# Altium schematic sheet NG2092_MICS.SchDoc: =project_title
size Tabloid; PageSetup: Record=PageOptions|CenterHorizontal=True|CenterVertical=True|PrintScale=0.73|XCorrection=1.00|YCorrection=1.00|PrintKind=0|BorderSize=5000000|LeftOffset=0|BottomOffset=0|Orientation=2|PaperLength=1000|PaperWidth=1000|Scale=100|PaperSource=7|PrintQuality=-4|MediaType=1|DitherType=10|PaperKind=A4|PrintScaleMode=1; CompanyName: Luxonis Holding; Organization: Luxonis Holding; Address1: 1925 Harmony Park Drive; Address2: Westminster, CO; Address3: 80234; Address4: United States; SheetNumber: 8; SheetTotal: 12
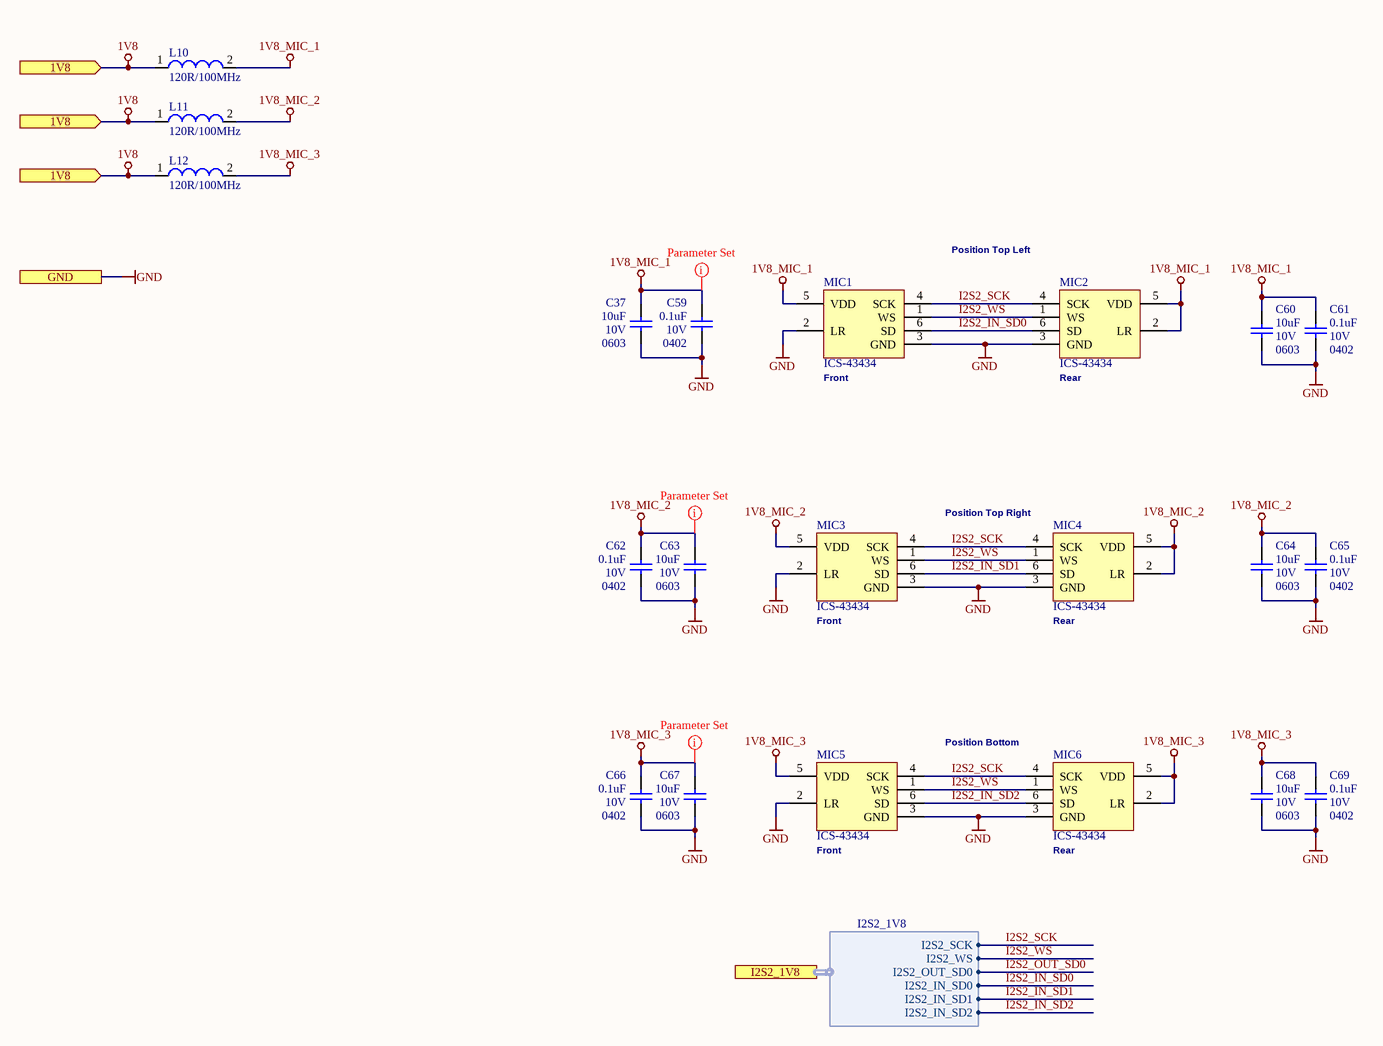
[diagram p0: NG2092_MICS.SchDoc]

## Parts
C37  Case Code (Imperial): 0603  Capacitance: 10uF  Voltage Rating: 10V  [CAPC0603(1608)100_L]  (hidden comment: 10uF 0603)
C59  Case/Package: 0402  Capacitance: 0.1uF  Voltage Rating: 10V  [CAPC0402(1005)70_L]  (hidden comment: 0.1uF 0402)
C60  Case Code (Imperial): 0603  Capacitance: 10uF  Voltage Rating: 10V  [CAPC0603(1608)100_L]  (hidden comment: 10uF 0603)
C61  Case/Package: 0402  Capacitance: 0.1uF  Voltage Rating: 10V  [CAPC0402(1005)70_L]  (hidden comment: 0.1uF 0402)
C62  Case/Package: 0402  Capacitance: 0.1uF  Voltage Rating: 10V  [CAPC0402(1005)70_L]  (hidden comment: 0.1uF 0402)
C63  Case Code (Imperial): 0603  Capacitance: 10uF  Voltage Rating: 10V  [CAPC0603(1608)100_L]  (hidden comment: 10uF 0603)
C64  Case Code (Imperial): 0603  Capacitance: 10uF  Voltage Rating: 10V  [CAPC0603(1608)100_L]  (hidden comment: 10uF 0603)
C65  Case/Package: 0402  Capacitance: 0.1uF  Voltage Rating: 10V  [CAPC0402(1005)70_L]  (hidden comment: 0.1uF 0402)
C66  Case/Package: 0402  Capacitance: 0.1uF  Voltage Rating: 10V  [CAPC0402(1005)70_L]  (hidden comment: 0.1uF 0402)
C67  Case Code (Imperial): 0603  Capacitance: 10uF  Voltage Rating: 10V  [CAPC0603(1608)100_L]  (hidden comment: 10uF 0603)
C68  Case Code (Imperial): 0603  Capacitance: 10uF  Voltage Rating: 10V  [CAPC0603(1608)100_L]  (hidden comment: 10uF 0603)
C69  Case/Package: 0402  Capacitance: 0.1uF  Voltage Rating: 10V  [CAPC0402(1005)70_L]  (hidden comment: 0.1uF 0402)
L10  120R/100MHz  [BLM18PG121SN1D_N]
L11  120R/100MHz  [BLM18PG121SN1D_N]
L12  120R/100MHz  [BLM18PG121SN1D_N]
MIC1  ICS-43434  [ICS-43434]
MIC2  ICS-43434  [ICS-43434]
MIC3  ICS-43434  [ICS-43434]
MIC4  ICS-43434  [ICS-43434]
MIC5  ICS-43434  [ICS-43434]
MIC6  ICS-43434  [ICS-43434]

## Ports
1V8 (in), GND, I2S2_1V8 (harness I2S2_1V8)

## Harnesses
I2S2_1V8: I2S2_SCK, I2S2_WS, I2S2_OUT_SD0, I2S2_IN_SD0, I2S2_IN_SD1, I2S2_IN_SD2

## Nets
1V8: L10.1 L11.1 L12.1 ; port 1V8
1V8_MIC_1: C37.2 C59.2 C60.2 C61.2 L10.2 MIC1.5(VDD) MIC2.2(LR) MIC2.5(VDD)
1V8_MIC_2: C62.2 C63.2 C64.2 C65.2 L11.2 MIC3.5(VDD) MIC4.2(LR) MIC4.5(VDD)
1V8_MIC_3: C66.2 C67.2 C68.2 C69.2 L12.2 MIC5.5(VDD) MIC6.2(LR) MIC6.5(VDD)
GND: C37.1 C59.1 C60.1 C61.1 C62.1 C63.1 C64.1 C65.1 C66.1 C67.1 C68.1 C69.1 MIC1.2(LR) MIC1.3(GND) MIC2.3(GND) MIC3.2(LR) MIC3.3(GND) MIC4.3(GND) MIC5.2(LR) MIC5.3(GND) MIC6.3(GND) ; port GND
I2S2_IN_SD0: MIC1.6(SD) MIC2.6(SD) ; port I2S2_1V8.I2S2_IN_SD0
I2S2_IN_SD1: MIC3.6(SD) MIC4.6(SD) ; port I2S2_1V8.I2S2_IN_SD1
I2S2_IN_SD2: MIC5.6(SD) MIC6.6(SD) ; port I2S2_1V8.I2S2_IN_SD2
I2S2_OUT_SD0: port I2S2_1V8.I2S2_OUT_SD0
I2S2_SCK: MIC1.4(SCK) MIC2.4(SCK) MIC3.4(SCK) MIC4.4(SCK) MIC5.4(SCK) MIC6.4(SCK) ; port I2S2_1V8.I2S2_SCK
I2S2_WS: MIC1.1(WS) MIC2.1(WS) MIC3.1(WS) MIC4.1(WS) MIC5.1(WS) MIC6.1(WS) ; port I2S2_1V8.I2S2_WS

## Layout directives
net class POWER: 1V8_MIC_1, 1V8_MIC_2, 1V8_MIC_3

## Notes on the sheet
- Position Top Left
- (near MIC1) Front
- (near MIC2) Rear
- Position Top Right
- (near MIC3) Front
- (near MIC4) Rear
- Position Bottom
- (near MIC5) Front
- (near MIC6) Rear
- Title
- Size:
- Date:
- Tabloid
- Number:
- Time:
- Revision:
- Sheet
- of
- Drawn by:

## Library data of the parts
C37 C60 C63 C64 C67 C68 = GRM188R61A106ME69D: CAP CER 10UF 10V X5R 0603 20%; Manufacturer 1: Murata; Material: Ceramic; Supplier 1: Digi-Key; Manufacturer Part Number 1: GRM188R61A106ME69D; Stock 1: 2873098; Pricing 1: 1=0.21000, 10=0.14100, 100=0.07130, 500=0.04876, 1000=0.04313 (USD); RoHS: Yes; Mount: Surface Mount; Case/Package: 0603; Weight: 0.000222oz; Case Code (Metric): 1608; Min Operating Temperature: -55°C; Max Operating Temperature: 85°C; Packaging: Tape and Reel; Tolerance: 20%; Dielectric: X5R; Voltage Rating (DC): 10V; Package Quantity: 4000; Termination: SMD/SMT; Length: 1.6mm; Height: 0.8mm; Width: 0.8mm; Thickness: 0.035inch; Depth: 0.8mm; REACH SVHC: Unknown; Lead Free: Lead Free; ComponentLink1URL: http://www.mouser.com/ds/2/281/c02e-2905.pdf?src-supplier=Mouser; ComponentLink1Description: http://www.mouser.com/ds/2/281/c02e-2905.pdf?src-supplier=Mouser; ComponentLink2URL: http://components.arrow.com/part/dataview/0323_06119472?src-supplier=Arrow+Europe; ComponentLink2Description: http://components.arrow.com/part/dataview/0323_06119472?src-supplier=Arrow+Europe; ComponentLink3URL: http://www.farnell.com/datasheets/2048014.pdf?src-supplier=Farnell; ComponentLink3Description: http://www.farnell.com/datasheets/2048014.pdf?src-supplier=Farnell; ComponentLink4URL: http://www.farnell.com/datasheets/1872210.pdf?src-supplier=Farnell; ComponentLink4Description: http://www.farnell.com/datasheets/1872210.pdf?src-supplier=Farnell; ComponentLink5URL: http://search.murata.co.jp/Ceramy/image/img/A01X/G101/ENG/GRM188R61A106ME69-01.pdf?src-supplier=Digi-Key; ComponentLink5Description: http://search.murata.co.jp/Ceramy/image/img/A01X/G101/ENG/GRM188R61A106ME69-01.pdf?src-supplier=Digi-Key; ComponentLink6URL: http://www.farnell.com/datasheets/1872210.pdf?src-supplier=Newark; ComponentLink6Description: http://www.farnell.com/datasheets/1872210.pdf?src-supplier=Newark; ComponentLink7URL: http://www.farnell.com/datasheets/2048014.pdf?src-supplier=Element14; ComponentLink7Description: http://www.farnell.com/datasheets/2048014.pdf?src-supplier=Element14; ComponentLink8URL: http://www.farnell.com/datasheets/2048014.pdf?src-supplier=Newark; ComponentLink8Description: http://www.farnell.com/datasheets/2048014.pdf?src-supplier=Newark; Supplier Part Number 1: 490-10475-1-ND
C59 C61 C62 C65 C66 C69 = GRM155R71A104JA01D: CAP CER 0.1UF 10V X7R 0402 5%; Manufacturer 1: Murata; Supplier 1: Digi-Key; Manufacturer Part Number 1: GRM155R71A104JA01D; Stock 1: 1346709; Pricing 1: 1=0.10000, 10=0.02500, 100=0.01130, 500=0.00806, 1000=0.00633, 2500=0.00575, 5000=0.00529 (USD); RoHS: Yes; Mount: Surface Mount; Case Code (Imperial): 0402; Case Code (Metric): 1005; Min Operating Temperature: -55°C; Max Operating Temperature: 125°C; Tolerance: 5%; Packaging: Tape and Reel; Voltage Rating (DC): 10V; Dielectric: X7R; Package Quantity: 10000; Termination: SMD/SMT; Length: 1mm; Height: 0.5mm; Width: 0.02inch; Thickness: 0.022inch; Depth: 0.5mm; Radiation Hardening: No; Lead Free: Lead Free; ComponentLink1URL: https://datasheet.ciiva.com/5411/product-5411135.pdf?src-supplier=Mouser; ComponentLink1Description: https://datasheet.ciiva.com/5411/product-5411135.pdf?src-supplier=Mouser; ComponentLink2URL: https://datasheet.ciiva.com/11618/c02e-11618821.pdf?src-supplier=Avnet; ComponentLink2Description: https://datasheet.ciiva.com/11618/c02e-11618821.pdf?src-supplier=Avnet; Supplier Part Number 1: 490-10777-1-ND
L10-L12 = BLM18PG121SN1D: FERRITE BEAD 120 OHM 0603 1LN; Manufacturer 1: Murata; Material: Steel,Ferrite; Tolerance: 25%; Impedance: 120R; DC Resistance (DCR): 50mR; Max DC Current: 2A; Number of Lines: 1; Test Frequency: 100MHz; Shielding: Unshielded; Supplier 1: Digi-Key; Manufacturer Part Number 1: BLM18PG121SN1D; Stock 1: 377829; Pricing 1: 1=0.10000, 10=0.07600, 25=0.06840, 50=0.05000, 100=0.04330, 250=0.03416, 500=0.02884, 1000=0.02429 (USD); RoHS: Yes; Case/Package: 0603; Number of Pins: 2; Core Material: Ferrite; Case Code (Metric): 1608; Case Code (Imperial): 0603; Min Operating Temperature: -55°C; Max Operating Temperature: 125°C; Package Quantity: 1; Max Current Rating: 2A; Packaging: Tape and Reel; Current Rating: 2A; Termination: SMD/SMT; DC Current: 2A; Frequency: 100MHz; Number of Circuits: 1; Length: 1.6mm; Height: 0.8mm; Width: 0.8mm; Depth: 0.8mm; Radiation Hardening: No; REACH SVHC: No SVHC; Lead Free: Lead Free; ComponentLink1URL: https://datasheet.ciiva.com/5709/1740433-5709171.pdf?src-supplier=Farnell; ComponentLink1Description: https://datasheet.ciiva.com/5709/1740433-5709171.pdf?src-supplier=Farnell; ComponentLink2URL: https://datasheet.ciiva.com/3854/5emiapbde-1-3854039.pdf?src-supplier=Arrow; ComponentLink2Description: https://datasheet.ciiva.com/3854/5emiapbde-1-3854039.pdf?src-supplier=Arrow; ComponentLink3URL: https://datasheet.ciiva.com/11799/0900766b81275ca5-11799546.pdf?src-supplier=RSComponents; ComponentLink3Description: https://datasheet.ciiva.com/11799/0900766b81275ca5-11799546.pdf?src-supplier=RSComponents; ComponentLink4URL: https://datasheet.ciiva.com/19454/1845013-19454715.pdf?src-supplier=Jameco; ComponentLink4Description: https://datasheet.ciiva.com/19454/1845013-19454715.pdf?src-supplier=Jameco; ComponentLink5URL: https://datasheet.ciiva.com/29347/442365-da-01-en-chip-drossel-0603-120r-2000ma-1-6x0-8mm-29347911.pdf?src-supplier=Conrad; ComponentLink5Description: https://datasheet.ciiva.com/29347/442365-da-01-en-chip-drossel-0603-120r-2000ma-1-6x0-8mm-29347911.pdf?src-supplier=Conrad; ComponentLink6URL: https://datasheet.ciiva.com/3081/l0110s0100blm18p-3081632.pdf?src-supplier=Avnet; ComponentLink6Description: https://datasheet.ciiva.com/3081/l0110s0100blm18p-3081632.pdf?src-supplier=Avnet; ComponentLink7URL: https://datasheet.ciiva.com/8021/1740433-8021493.pdf?src-supplier=Element14; ComponentLink7Description: https://datasheet.ciiva.com/8021/1740433-8021493.pdf?src-supplier=Element14; ComponentLink8URL: https://datasheet.ciiva.com/6212/l0110s0100blm18p-6212502.pdf?src-supplier=Digi-Key; ComponentLink8Description: https://datasheet.ciiva.com/6212/l0110s0100blm18p-6212502.pdf?src-supplier=Digi-Key; ComponentLink9URL: https://datasheet.ciiva.com/8021/1740433-8021494.pdf?src-supplier=Element14; ComponentLink9Description: https://datasheet.ciiva.com/8021/1740433-8021494.pdf?src-supplier=Element14; ComponentLink10URL: https://datasheet.ciiva.com/6212/l0110s0100blm18p-6212504.pdf?src-supplier=Digi-Key; ComponentLink10Description: https://datasheet.ciiva.com/6212/l0110s0100blm18p-6212504.pdf?src-supplier=Digi-Key; ComponentLink11URL: https://datasheet.ciiva.com/14122/blm-series-eng-tds-14122905.pdf?src-supplier=Distrelec; ComponentLink11Description: https://datasheet.ciiva.com/14122/blm-series-eng-tds-14122905.pdf?src-supplier=Distrelec; ComponentLink12URL: https://datasheet.ciiva.com/25903/l0110s0100blm18p-25903483.pdf?src-supplier=Avnet+Europe; ComponentLink12Description: https://datasheet.ciiva.com/25903/l0110s0100blm18p-25903483.pdf?src-supplier=Avnet+Europe; ComponentLink13URL: https://datasheet.ciiva.com/41449/001172297-da-01-en-drossel-0603-120r-1-6x0-8mm-4000st-41449659.pdf?src-supplier=Conrad; ComponentLink13Description: https://datasheet.ciiva.com/41449/001172297-da-01-en-drossel-0603-120r-1-6x0-8mm-4000st-41449659.pdf?src-supplier=Conrad; Supplier 2: Mouser; Supplier 3: Newark; Supplier Part Number 1: 490-1037-1-ND; Supplier Part Number 2: 81-BLM18PG121SN1D; Supplier Part Number 3: 73M9109
MIC1-MIC6 = ICS-43434: 60Hz ~ 20kHz Digital, I2S Microphone MEMS _Silicon_ 1.65V ~ 3.63V Omnidirectional _-26 ±1dB @ 94dB SPL_ Solder Pads; Manufacturer 1: TDK InvenSense; Consumer IC Type: CONSUMER CIRCUIT; Supplier 1: Digi-Key; RoHS: No; Category: Microphones; REACH SVHC: No SVHC; RoHS Compliant: No; ComponentLink1URL: https://datasheet.ciiva.com:443/pdfs/VipMasterIC/IC/IVNC/IVNC-S-A0005715430/IVNC-S-A0005715430-1.pdf?src-supplier=IHS+Markit; ComponentLink1Description: https://datasheet.ciiva.com:443/pdfs/VipMasterIC/IC/IVNC/IVNC-S-A0005715430/IVNC-S-A0005715430-1.pdf?src-supplier=IHS+Markit; ComponentLink2URL: http://www.farnell.com/datasheets/2632666.pdf?src-supplier=Farnell; ComponentLink2Description: http://www.farnell.com/datasheets/2632666.pdf?src-supplier=Farnell; ComponentLink3URL: https://www.invensense.com/wp-content/uploads/2016/02/PB-000018-ICS-43434-v1.1.pdf?src-supplier=Digi-Key; ComponentLink3Description: https://www.invensense.com/wp-content/uploads/2016/02/PB-000018-ICS-43434-v1.1.pdf?src-supplier=Digi-Key; ComponentLink4URL: http://www.farnell.com/datasheets/2632666.pdf?src-supplier=Element14; ComponentLink4Description: http://www.farnell.com/datasheets/2632666.pdf?src-supplier=Element14; ComponentLink5URL: https://www.invensense.com/wp-content/uploads/2016/02/DS-000069-ICS-43434-v1.2.pdf?src-supplier=Digi-Key; ComponentLink5Description: https://www.invensense.com/wp-content/uploads/2016/02/DS-000069-ICS-43434-v1.2.pdf?src-supplier=Digi-Key; ComponentLink6URL: http://www.farnell.com/datasheets/2632666.pdf?src-supplier=Newark; ComponentLink6Description: http://www.farnell.com/datasheets/2632666.pdf?src-supplier=Newark; Supplier Part Number 1: 1428-1066-1-ND; Manufacturer Part Number 1: ICS-43434; Stock 1: 38549; Pricing 1: 1=2,62000, 10=2,16800, 25=2,00160, 50=1,88080, 100=1,76430, 500=1,52950 (USD)